# EAGLE design relay driver (EAGLE 6.1)
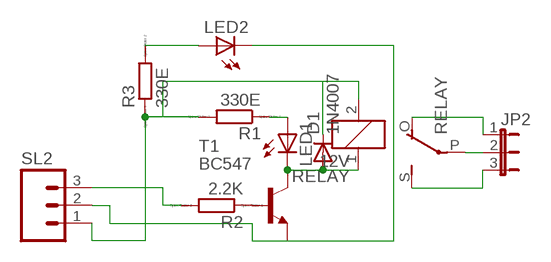
[diagram p0: schematic, sheet 1]

## Parts
D1  1N4007  1N4004  [DO41-10]
JP2  JP2E  [JP2]
LED1  LED3MM  [LED3MM]
LED2  LED3MM  [LED3MM]
R1  330E  R0204/7  [0204/7]
R2  2.2K  R0204/7  [0204/7]
R3  330E  R0204/7  [0204/7]
RELAY  12V  G5L  [G5LE]
SL2  M03  [03P]
T1  BC547  [TO92]

## Nets
N$1: D1.A LED1.K(C) RELAY.1 T1.3(C)
N$2: JP2.2 RELAY.P(2:P)
N$3: LED1.A R1.1
N$4: R2.1 T1.2(B)
N$5: LED2.K(C) SL2.2 T1.1(E)
N$6: D1.C R1.2 R3.1 RELAY.2 SL2.1
N$7: R2.2 SL2.3
N$8: JP2.3 RELAY.S(2:S)
N$9: LED2.A R3.2
N$10: JP2.1 RELAY.O(2:O)

## Library data of the parts
D1 = diode:1N4004: DIODE general purpose rectifier, 1 A
JP2 = jumper:JP2E: JUMPER
LED1 LED2 = led:LED: LED OSRAM: - CHIPLED LG R971, LG N971, LY N971, LG Q971, LY Q971, LO R971, LY R971 LH N974, LH R974 LS Q976, LO Q976, LY Q976 LO Q996 - Hyper CHIPLED LW Q18S LB Q993, LB Q99A, LB R99A - SideLED LS A670, LO A670, LY A670, LG A670, LP A670 LB A673, LV A673, LT A673, LW A673 LH A674 LY A675 LS A676, LA A676, LO A676, LY A676, LW A676 LS A679, LY A679, LG A679 - Hyper Micro SIDELED® LS Y876, LA Y876, LO Y876, LY Y876 LT Y87S - SmartLED LW L88C, LW L88S LB L89C, LB L89S, LG L890 LS L89K, LO L89K, LY L89K LS L896, LA L896, LO L896, LY L896 - TOPLED LS T670, LO T670, LY T670, LG T670, LP T670 LSG T670, LSP T670, LSY T670, LOP T670, LYG T670 LG T671, LOG T671, LSG T671 LB T673, LV T673, LT T673, LW T673 LH T674 LS T676, LA T676, LO T676, LY T676, LB T676, LH T676, LSB T676, LW T676 LB T67C, LV T67C, LT T67C, LS T67K, LO T67K, LY T67K, LW E67C LS E67B, LA E67B, LO E67B, LY E67B, LB E67C, LV E67C, LT E67C LW T67C LS T679, LY T679, LG T679 LS T770, LO T770, LY T770, LG T770, LP T770 LB T773, LV T773, LT T773, LW T773 LH T774 LS E675, LA E675, LY E675, LS T675 LS T776, LA T776, LO T776, LY T776, LB T776 LHGB T686 LT T68C, LB T68C - Hyper Mini TOPLED® LB M676 - Mini TOPLED Santana® LG M470 LS M47K, LO M47K, LY M47K Source: http://www.osram.convergy.de LUXEON: - LUMILED® LXK2-PW12-R00, LXK2-PW12-S00, LXK2-PW14-U00, LXK2-PW14-V00 LXK2-PM12-R00, LXK2-PM12-S00, LXK2-PM14-U00 LXK2-PE12-Q00, LXK2-PE12-R00, LXK2-PE12-S00, LXK2-PE14-T00, LXK2-PE14-U00 LXK2-PB12-K00, LXK2-PB12-L00, LXK2-PB12-M00, LXK2-PB14-N00, LXK2-PB14-P00, LXK2-PB14-Q00 LXK2-PR12-L00, LXK2-PR12-M00, LXK2-PR14-Q00, LXK2-PR14-R00 LXK2-PD12-Q00, LXK2-PD12-R00, LXK2-PD12-S00 LXK2-PH12-R00, LXK2-PH12-S00 LXK2-PL12-P00, LXK2-PL12-Q00, LXK2-PL12-R00 Source: www.luxeon.com KINGBRIGHT: KA-3528ASYC Source: www.kingbright.com
R1-R3 = eagle-ltspice:R: RESISTOR, European symbol; SPICEMODEL: NONE; SPICEPREFIX: R
RELAY = relay:G5L: RELAY 1 x switch, 10 A/120 V AC, 8 A/30 V ADC, Omron; OC_FARNELL: unknown; OC_NEWARK: unknown
SL2 = con-amp-quick:M03: AMP QUICK CONNECTOR; OC_FARNELL: unknown; OC_NEWARK: unknown
T1 = transistor:BC547: NPN TRANSISTOR

## Board
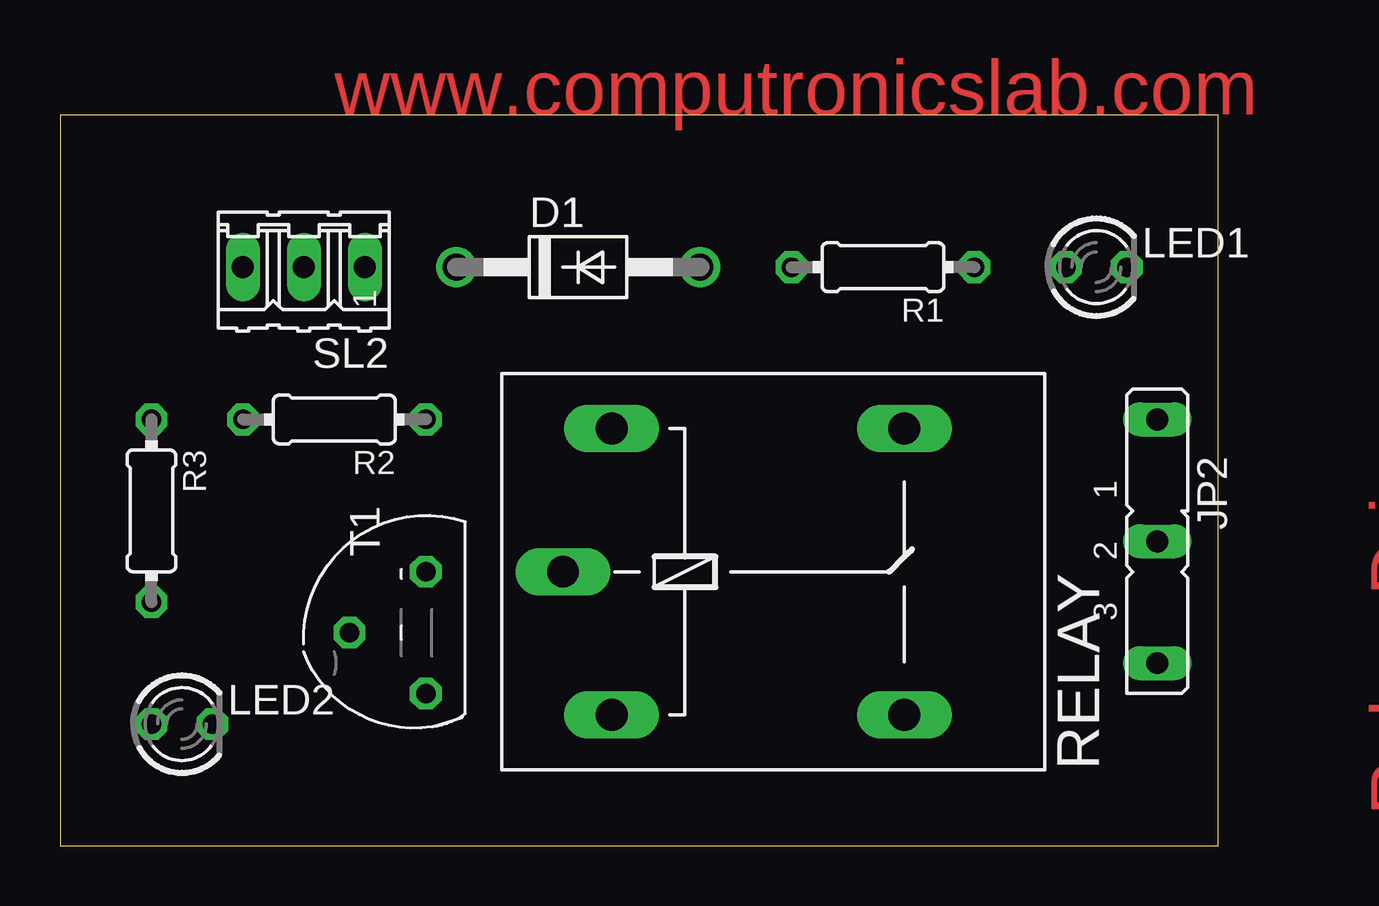
[diagram p1: board, top side]
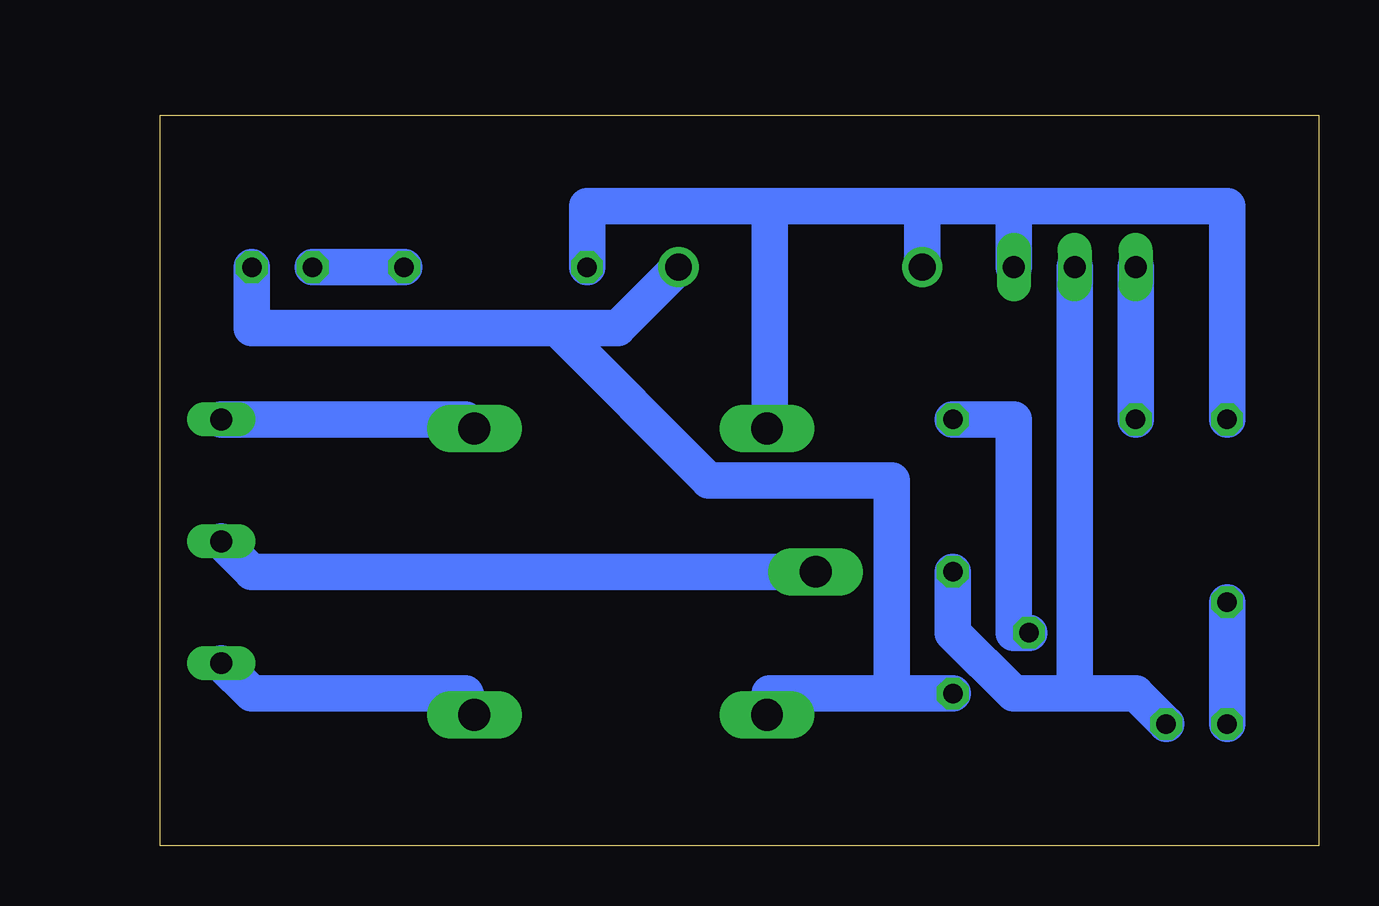
[diagram p2: board, bottom side, seen from below]

Size 48.26 x 30.47 mm. Coordinates in mm from the lower left corner, seen from the top.
Outline: 0,0 48.26,0 48.26,30.47 0,30.47 0,0
Copper layers (1*16): Top 0.035mm / dielectric 1.5mm / Bottom 0.035mm
Design rules: minimum track width 60mil, minimum drill 24mil, track to track 8mil, track to pad 8mil, pad to pad 8mil, via to via 8mil, smd to smd 8mil, copper to edge 40mil, drill to drill 8mil, minimum pad ring 10mil, minimum via ring 8mil, stop-mask expansion 4mil, vias tented up to drill 0mil, thermal gap 10mil

### Footprints (pad centres in the part's own frame; a part is rotated, then mirrored left to right if it is on the bottom)
DO41-10 = drill 1.118: A 5.08,0; C -5.08,0
JP2 = drill 0.914 long: 1 -5.08,0; 2 0,0; 3 5.08,0
LED3MM = drill 0.813 octagon: A -1.27,0; K 1.27,0
0204/7 = drill 0.813 octagon: 1 -3.81,0; 2 3.81,0
G5LE = drill 1.321 long: 1 -7.493,-5.969; 2 -7.493,5.969; O 4.699,5.969; P -9.525,0; S 4.699,-5.969
03P = drill 0.914 long: 1 -2.54,0; 2 0,0; 3 2.54,0
TO92 = drill 0.813 octagon: 1 2.54,-1.27; 2 0,1.905; 3 -2.54,-1.27

### Placement (x,y rotation side)
D1  21.59,24.13 0 top
JP2  45.72,12.7 270 top
LED1  43.18,24.13 0 top
LED2  5.08,5.08 0 top
R1  34.29,24.13 180 top
R2  11.43,17.78 180 top
R3  3.81,13.97 270 top
RELAY  30.48,11.43 0 top
SL2  10.16,24.13 180 top
T1  13.97,8.89 90 top

### Tracks (layer width: path | path; a pad name or v marks a point on that pad's centre or on a via)
N$1
  Bottom 1.524: 17.78,6.35 22.86,6.35 RELAY.1 | 17.78,6.35 T1.3 | LED1.K 44.45,21.59 31.75,21.59 | 31.75,21.59 29.21,21.59 D1.A | 17.78,6.35 17.78,15.24 25.4,15.24 31.75,21.59
N$2
  Bottom 1.524: JP2.2 44.45,11.43 21.59,11.43 RELAY.P
N$3
  Bottom 1.524: LED1.A R1.1
N$4
  Bottom 1.524: R2.1 12.7,17.78 12.7,8.89 T1.2
N$5
  Bottom 1.524: LED2.K 7.62,6.35 10.16,6.35 | 10.16,6.35 12.7,6.35 15.24,8.89 T1.1 | 10.16,6.35 SL2.2
N$6
  Bottom 1.524: R3.1 3.81,26.67 12.7,26.67 | 16.51,26.67 12.7,26.67 | D1.C 16.51,26.67 | R1.2 30.48,26.67 22.86,26.67 | 16.51,26.67 22.86,26.67 | 12.7,26.67 SL2.1 | 22.86,26.67 22.86,17.78 RELAY.2
N$7
  Bottom 1.524: SL2.3 R2.2
N$8
  Bottom 1.524: JP2.3 44.45,6.35 35.56,6.35 RELAY.S
N$9
  Bottom 1.524: R3.2 LED2.A
N$10
  Bottom 1.524: JP2.1 35.56,17.78 RELAY.O

### Text on the board
Top: www.computronicslab.com | Relay Driver
Bottom: Relay Driver | www.computronicslab.com